# Altium project Board3.PrjPcb
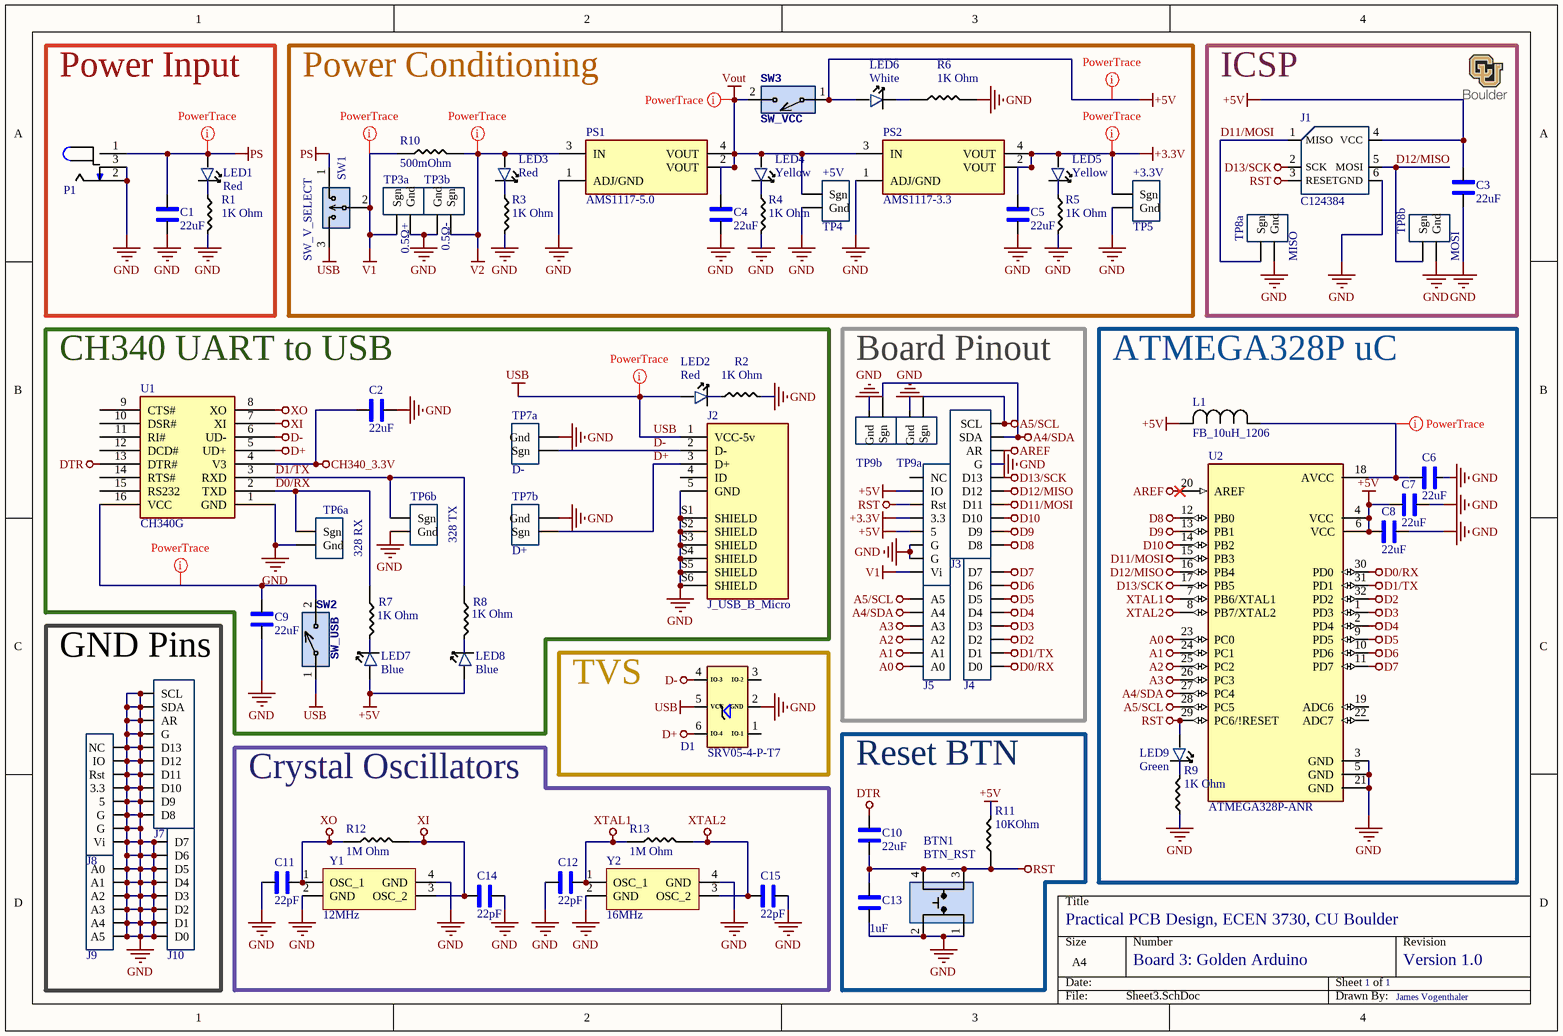
[diagram p0: Sheet3.SchDoc]
1 sheet, 72 parts. Net scope: global (net labels, ports and power ports of the same name join across sheets).
Board file: PCB3.PcbDoc

## Sheet Sheet3.SchDoc: Golden Arduino
size A4; Author: James Vogenthaler; CompanyName: CU Boulder; DrawnBy: James Vogenthaler; Engineer: James Vogenthaler; Organization: CU Boulder; Address1: Boulder, CO; DocumentNumber: 3; Revision: Board 3; SheetNumber: 1; SheetTotal: 1

### Parts
BTN1  BTN_RST  [Switch_JLC]
C1  22uF  [1206_Passive_Capacitor]
C2  22uF  [1206_Passive_Capacitor]
C3  22uF  [1206_Passive_Capacitor]
C4  22uF  [1206_Passive_Capacitor]
C5  22uF  [1206_Passive_Capacitor]
C6  22uF  [1206_Passive_Capacitor]
C7  22uF  [1206_Passive_Capacitor]
C8  22uF  [1206_Passive_Capacitor]
C9  22uF  [1206_Passive_Capacitor]
C10  22uF  [1206_Passive_Capacitor]
C11  22pF  [1206_Passive_Capacitor]
C12  22pF  [1206_Passive_Capacitor]
C13  1uF  [1206_Passive_Capacitor]
C14  22pF  [1206_Passive_Capacitor]
C15  22pF  [1206_Passive_Capacitor]
D1  SRV05-4-P-T7  [TVS]
J1  LCSC Part#: C124384  [ICSP]  (hidden comment: NRPN032PAEN-RC)
J2  J_USB_B_Micro  [AMPHENOL_10118194-0001LF]
J3  PPTC101LFBN-RC  [10_PIN_ARDUINO_100MIL]  (value not drawn)
J4  PPTC081LFBN-RC  [8_PIN_ARD-DIG_100MIL]  (value not drawn)
J5  PPTC061LFBN-RC  [6_PIN_ARD-Analog_100mil]  (value not drawn)
J6  PPTC081LFBN-RC  [8_PIN_ARD-PWR_100MIL]  (value not drawn)
J7  PPTC101LFBN-RC  [10_PIN_ARDUINO_100MIL]  (value not drawn)
J8  PPTC081LFBN-RC  [8_PIN_ARD-PWR_100MIL]  (value not drawn)
J9  PPTC061LFBN-RC  [6_PIN_ARD-Analog_100mil]  (value not drawn)
J10  PPTC081LFBN-RC  [8_PIN_ARD-DIG_100MIL]  (value not drawn)
L1  FB_10uH_1206  [AIML-1206_ABR-M]
LED1  value Red  [LED_1206]  (hidden comment: Power)
LED2  value Red  [LED_1206]  (hidden comment: USB)
LED3  value Red  [LED_1206]  (hidden comment: VIN)
LED4  value Yellow  [LED_1206]  (hidden comment: +5V)
LED5  value Yellow  [LED_1206]  (hidden comment: +3.3V)
LED6  White  [LED_1206]
LED7  value Blue  [LED_1206]  (hidden comment: RX)
LED8  value Blue  [LED_1206]  (hidden comment: TX)
LED9  value Green  [LED_1206]  (hidden comment: SCK)
P1  Power Jack  [Power_Jack]  (value not drawn)
PS1  AMS1117-5.0  [LDO]
PS2  AMS1117-3.3  [LDO]
R1  value 1K Ohm  [1206_Passive_Resitor]  (hidden comment: 1k)
R2  value 1K Ohm  [1206_Passive_Resitor]  (hidden comment: 1k)
R3  value 1K Ohm  [1206_Passive_Resitor]  (hidden comment: 1k)
R4  value 1K Ohm  [1206_Passive_Resitor]  (hidden comment: 1k)
R5  value 1K Ohm  [1206_Passive_Resitor]  (hidden comment: 1k)
R6  value 1K Ohm  [1206_Passive_Resitor]  (hidden comment: 1k)
R7  value 1K Ohm  [1206_Passive_Resitor]  (hidden comment: 1k)
R8  value 1K Ohm  [1206_Passive_Resitor]  (hidden comment: 1k)
R9  value 1K Ohm  [1206_Passive_Resitor]  (hidden comment: 1k)
R10  value 500mOhm  [1206_Passive_Resitor]  (hidden comment: 500m)
R11  value 10KOhm  [1206_Passive_Resitor]  (hidden comment: 10k)
R12  value 1M Ohm  [1206_Passive_Resitor]  (hidden comment: 1M)
R13  value 1M Ohm  [1206_Passive_Resitor]  (hidden comment: 1M)
SW1  SW_V_SELECT  [3_PIN_100mil]
SW2  SW_USB  [2Pin-Header-Conn]
SW3  SW_VCC  [2Pin-Header-Conn]
TP3a  0.5Ω+  [TP10x_Probe]
TP3b  0.5Ω-  [TP10x_Probe]
TP4  +5V  [TP10x_Probe]
TP5  +3.3V  [TP10x_Probe]
TP6a  328 RX  [TP10x_Probe]
TP6b  328 TX  [TP10x_Probe]
TP7a  D-  [TP10x_Probe]
TP7b  D+  [TP10x_Probe]
TP8a  MISO  [TP10x_Probe]
TP8b  MOSI  [TP10x_Probe]
TP9a  SDA  [TP10x_Probe]  (value not drawn)
TP9b  SCL  [TP10x_Probe]  (value not drawn)
U1  CH340G  [USB to serial]
U2  ATMEGA328P-ANR  [ATMega328P]
Y1  12MHz  [Crystal resonator]
Y2  value 16MHz  [Crystal resonator]  (hidden comment: X322516MLB4SI)

### Blocks framed on the sheet
Power Input: C1 LED1 P1 R1
Power Conditioning: C4 C5 LED3-LED6 PS1 PS2 R3-R6 R10 SW1 SW3 TP3a TP3b TP4 TP5
ICSP: C3 J1 TP8a TP8b
CH340 UART to USB: C2 C9 J2 LED2 LED7 LED8 R2 R7 R8 SW2 TP6a TP6b TP7a TP7b U1
Board Pinout: J3-J6 TP9a TP9b
ATMEGA328P uC: C6-C8 L1 LED9 R9 U2
GND Pins: J7-J10
TVS: D1
Reset BTN: BTN1 C10 C13 R11
Crystal Oscillators: C11 C12 C14 C15 R12 R13 Y1 Y2

### Nets
+3.3V: C5.2 J6.4(3.3) LED5.1 PS2.2(VOUT) PS2.4(VOUT) TP5.1(Sgn)
+5V: C3.2 C7.2 C8.2 J1.4(VCC) J6.2(IO) J6.5 L1.2 LED6.1 LED7.1 LED8.1 R11.2 SW3.1 U2.4(VCC) U2.6(VCC)
A0: J5.1(A0) U2.23(PC0)
A1: J5.2(A1) U2.24(PC1)
A2: J5.3(A2) U2.25(PC2)
A3: J5.4(A3) U2.26(PC3)
A4/SDA: J3.2(SDA) J5.5(A4) TP9b.1(Sgn) U2.27(PC4)
A5/SCL: J3.1(SCL) J5.6(A5) TP9a.1(Sgn) U2.28(PC5)
AREF: J3.3(AR) U2.20(AREF)
CH340_3.3V: C2.2 U1.4(V3)
D0/RX: J4.8(D0) R7.1 TP6a.1(Sgn) U1.2(TXD) U2.30(PD0)
D1/TX: J4.7(D1) R8.1 TP6b.1(Sgn) U1.3(RXD) U2.31(PD1)
D2: J4.6(D2) U2.32(PD2)
D3: J4.5(D3) U2.1(PD3)
D4: J4.4(D4) U2.2(PD4)
D5: J4.3(D5) U2.9(PD5)
D6: J4.2(D6) U2.10(PD6)
D7: J4.1(D7) U2.11(PD7)
D8: J3.10(D8) U2.12(PB0)
D9: J3.9(D9) U2.13(PB1)
D10: J3.8(D10) U2.14(PB2)
D11/MOSI: J1.1(MISO) J3.7(D11) TP8a.1(Sgn) U2.15(PB3)
D12/MISO: J1.5(MOSI) J3.6(D12) TP8b.1(Sgn) U2.16(PB4)
D13/SCK: J1.2(SCK) J3.5(D13) U2.17(PB5)
D+: D1.6(IO-4) J2.3(D+) TP7b.1(Sgn) U1.5(UD+)
D-: D1.4(IO-3) J2.2(D-) TP7a.1(Sgn) U1.6(UD-)
DTR: C10.1 U1.13(DTR#)
GND: BTN1.1 BTN1.2 C1.1 C2.1 C3.1 C4.1 C5.1 C6.1 C7.1 C8.1 C9.1 C11.2 C12.2 C13.1 C14.2 C15.2 D1.2(GND) J1.6(GND) J2.5(GND) J2.S1(SHIELD) J2.S2(SHIELD) J2.S3(SHIELD) J2.S4(SHIELD) J2.S5(SHIELD) J2.S6(SHIELD) J3.4(G) J6.6(G) J6.7(G) J7.1(SCL) J7.2(SDA) J7.3(AR) J7.4(G) J7.5(D13) J7.6(D12) J7.7(D11) J7.8(D10) J7.9(D9) J7.10(D8) J8.1(NC) J8.2(IO) J8.3(Rst) J8.4(3.3) J8.5 J8.6(G) J8.7(G) J8.8(Vi) J9.1(A0) J9.2(A1) J9.3(A2) J9.4(A3) J9.5(A4) J9.6(A5) J10.1(D7) J10.2(D6) J10.3(D5) J10.4(D4) J10.5(D3) J10.6(D2) J10.7(D1) J10.8(D0) P1.2 P1.3 PS1.1(ADJ/GND) PS2.1(ADJ/GND) R1.2 R2.2 R3.2 R4.2 R5.2 R6.2 R9.1 TP3a.2(Gnd) TP3b.2(Gnd) TP4.2(Gnd) TP5.2(Gnd) TP6a.2(Gnd) TP6b.2(Gnd) TP7a.2(Gnd) TP7b.2(Gnd) TP8a.2(Gnd) TP8b.2(Gnd) TP9a.2(Gnd) TP9b.2(Gnd) U1.1(GND) U2.3(GND) U2.5(GND) U2.21(GND) Y1.2(GND) Y1.4(GND) Y2.2(GND) Y2.4(GND)
PS: C1.2 LED1.1 P1.1 SW1.1
RST: BTN1.3 BTN1.4 C10.2 C13.2 J1.3(RESET) J6.3(Rst) LED9.1 R11.1 U2.29(PC6/!RESET)
USB: D1.5(VCC) J2.1(VCC-5v) LED2.1 SW1.3 SW2.1
V1: J6.8(Vi) R10.1 SW1.2 TP3a.1(Sgn)
V2: LED3.1 PS1.3(IN) R10.2 TP3b.1(Sgn)
Vout: C4.2 LED4.1 PS1.2(VOUT) PS1.4(VOUT) PS2.3(IN) SW3.2 TP4.1(Sgn)
XI: C14.1 R12.2 U1.7(XI) Y1.3(OSC_2)
XO: C11.1 R12.1 U1.8(XO) Y1.1(OSC_1)
XTAL1: C12.1 R13.1 U2.7(PB6/XTAL1) Y2.1(OSC_1)
XTAL2: C15.1 R13.2 U2.8(PB7/XTAL2) Y2.3(OSC_2)
NetC6_2: C6.2 L1.1 U2.18(AVCC)
NetC9_2: C9.2 SW2.2 U1.16(VCC)
NetLED1_2: LED1.2 R1.1
NetLED2_2: LED2.2 R2.1
NetLED3_2: LED3.2 R3.1
NetLED4_2: LED4.2 R4.1
NetLED5_2: LED5.2 R5.1
NetLED6_2: LED6.2 R6.1
NetLED7_2: LED7.2 R7.2
NetLED8_2: LED8.2 R8.2
NetLED9_2: LED9.2 R9.2

Not connected (* = marked no-connect by the designer): D1 1(IO-1) 3(IO-2); J2 4(ID); J6 1(NC); U1 9(CTS#) 10(DSR#) 11(RI#) 12(DCD#) 14(RTS#) 15(RS232); U2 19(ADC6) 22(ADC7)

### Layout directives
rule Width Constraint [Pref Width = 20mil    Min Width = 10mil    Max Width = 100mil]: +3.3V, +5V, NetC6_2, NetC9_2, PS, USB, V1, V2, Vout

### Notes on the sheet
- Practical PCB Design, ECEN 3730, CU Boulder
- Board 3: Golden Arduino
- Version 1.0

### Library data of the parts
BTN1 = SW_Push_Button_JLC: Tactile Switch SPST-NO Top Actuated Surface Mount; MFR Part #: KH-4.5X4.5X4.3H-STM; LCSC Part#: C2837550; Type: Extended; DataSheet: https://datasheet.lcsc.com/lcsc/2106081532_Shenzhen-Kinghelm-Elec-KH-4.5X4.5X4.3H-STM_C2837550.pdf
C1-C10 = C_22uF_1206: 22uF ±10% 25V X5R 1206 Multilayer Ceramic Capacitors MLCC - SMD/SMT RoHS; MFR Part #: CL31A226KAHNNNE; Type: basic; LCSC Part#: C12891; Datasheet: https://datasheet.lcsc.com/lcsc/1811031514_Samsung-Electro-Mechanics-CL31A226KAHNNNE_C12891.pdf; Value: 22uF
C11 C12 C14 C15 = C_22pF_1206: 22pF ±5% 1kV C0G 1206 Multilayer Ceramic Capacitors MLCC - SMD/SMT RoHS; MFR Part #: CC1206JKNPOCBN220; Type: Extended; LCSC Part#: C107174; Datasheet: https://datasheet.lcsc.com/lcsc/1810241219_YAGEO-CC1206JKNPOCBN220_C107174.pdf; Value: 22pF
C13 = C_1uF_1206: MULTILAYER CERAMIC CAPACITORS MLCC - SMD/SMT 1UF 50V 1206 ROHS; MFR Part #: CL31B105KBHNNNE; Type: Basic; Digikey Link: https://www.digikey.com/product-detail/en/C1206C105M4RACTU/399-8150-1-ND/3471873/?itemSeq=304982366; LCSC Part#: C1848; Value: 1uF
D1 = D_TVS_Diode: TVS SOT-23-6 ROHS; Value: TVS DIODE 5.5V 6TSOP; Type: Basic; MFR Part #: SRV05-4-P-T7; LCSC Part#: C85364; Datasheet: https://datasheet.lcsc.com/szlcsc/ProTek-Devices-SRV05-4-P-T7_C85364.pdf
J1 = J_ICSP: Connector Header Through Hole 6 position 0.079" (2.00mm); pin to pad: 1>5 5>1; Digikey Link: https://www.digikey.com/product-detail/en/NRPN032PAEN-RC/S5801-03-ND/804955/?itemSeq=304982355; MFR Part #: NRPN032PAEN-RC; Type: Extended
J2 = J_USB_B_Micro: Micro Usb, 2.0 Type b, Rcpt, Smt; MFR: Amphenol ICC; MFR Part #: 10118194-0001LF; Digikey link: https://www.digikey.com/en/products/detail/amphenol-cs-fci/10118194-0001LF/2785389?s=N4IgTCBcDaIAQEYAMCEA4EE4AsBaJBCAMgGJwgC6AvkA; DataSheet: https://www.amphenol-cs.com/media/wysiwyg/files/drawing/10118194.pdf; LCSC Part#: C132563; Type: Extended
J3 J7 = JF_10_PIN_FEMA_ARDUINO: 10 Position Header Connector 0.100" (2.54mm) Through Hole Tin; Value: Female; Digikey Link: https://www.digikey.com/product-detail/en/PPTC101LFBN-RC/S7008-ND/810149/?itemSeq=304982352; MFR Part #: PPTC101LFBN-RC; LCSC Part#: C225507; Type: Extended
J4 J10 = JF_8_PIN_FEMA_ARD-Dig: 8 Position Header Connector 0.100" (2.54mm) Through Hole Tin; Value: Female; Digikey Link: https://www.digikey.com/product-detail/en/PPTC081LFBN-RC/S7006-ND/810147/?itemSeq=304982354; MFR Part #: PPTC081LFBN-RC; Type: Extended; LCSC Part#: C27438
J5 J9 = JF_6_PIN_FEMA_ARD-Anolog: 6 Position Header Connector 0.100" (2.54mm) Through Hole Tin; Value: Female; Digikey Link: https://www.digikey.com/product-detail/en/PPTC061LFBN-RC/S7004-ND/810145/?itemSeq=304982353; MFR Part #: PPTC061LFBN-RC; LCSC Part#: C40877; Type: Extended
J6 J8 = JF_8_PIN_FEMA_ARD-Pwr: 8 Position Header Connector 0.100" (2.54mm) Through Hole Tin; Value: Female; Digikey Link: https://www.digikey.com/product-detail/en/PPTC081LFBN-RC/S7006-ND/810147/?itemSeq=304982354; MFR Part #: PPTC081LFBN-RC; Type: Extended; LCSC Part#: C27438
L1 = FB_10uH_1206: 25mA 10uH ±10% 800mΩ 1206  Inductors (SMD) ROHS; Mfr_Name: FH (Guangdong Fenghua Advanced Tech); MFR PART #: CMI321609X100KT; Type: Basic; LCSC PART#: C1051; DataSheet: https://datasheet.lcsc.com/lcsc/1810311314_FH--Guangdong-Fenghua-Advanced-Tech-CMI321609X100KT_C1051.pdf
LED1-LED3 = LED_RED_1206: Red 621~631nm 1206 Light Emitting Diodes (LED) RoHS; MFR Part #: 15-21/R6C-FQ1R1B/2T; Type: Extended; LCSC Part#: C93133; Datasheet: https://datasheet.lcsc.com/szlcsc/1811151241_Everlight-Elec-15-21-R6C-FQ1R1B-2T_C93133.pdf
LED4 LED5 = LED_YELLOW_1206: yellow 1206  Light Emitting Diodes (LED) ROHS; MFR Part #: NCD1206Y1; Type: Extended; LCSC Part#: C93094; Datasheet: https://datasheet.lcsc.com/lcsc/2008201033_Foshan-NationStar-Optoelectronics-NCD1206Y1_C93094.pdf
LED6 = LED_WHITE_1206: White light 1206  Light Emitting Diodes (LED) ROHS; MFR Part #: NCD1206W1; Type: Extended; LCSC Part#: C130718; Datasheet: https://datasheet.lcsc.com/lcsc/2008201033_Foshan-NationStar-Optoelectronics-NCD1206W1_C130718.pdf; Value: White
LED7 LED8 = LED_BLUE_1206: blue 1206  Light Emitting Diodes (LED) ROHS; MFR Part #: NCD1206B1; Type: Extended; LCSC Part#: C130717; Datasheet: https://datasheet.lcsc.com/lcsc/2008201033_Foshan-NationStar-Optoelectronics-NCD1206B1_C130717.pdf
LED9 = LED_GREEN_1206: Green 513~528nm 1206 Light Emitting Diodes (LED) RoHS; MFR Part #: SZYY1206G; Type: Extended; LCSC Part#: C434439; Datasheet: https://datasheet.lcsc.com/lcsc/2006301532_Yongyu-Photoelectric-SZYY1206G_C434439.pdf
P1 = P_Power Jack: Power Barrel Connector Jack 2.10mm ID (0.083"), 5.50mm OD (0.217") Through Hole, Right Angle; MFR Part #: PJ-102A; Value: CONN PWR JACK 2X5.5MM SOLDER; Digikey Link: https://www.digikey.com/product-detail/en/PJ-102A/CP-102A-ND/275425/?itemSeq=304982367; LCSC Part#: C136744; Type: Extended
PS1 = PS_AMS_LDO_5V: LOW DROPOUT REGULATORS(LDO) POSITIVE FIXED 1.3V @ 1A 15V 5V 1A SOT-223 ROHS; Value: IC REG LINEAR 5V 1A SOT223; MFR Part #: AMS1117-5.0; LCSC Part#: C6187; Type: Basic
PS2 = PS_AMS_LDO_3v3: LOW DROPOUT REGULATORS(LDO) POSITIVE FIXED 1.3V @ 800MA 15V 3.3V 1A SOT-223 ROHS; Value: IC REG LINEAR 3.3V 800MA SOT223; MFR Part #: AMS1117-3.3; LCSC Part#: C6186; Type: Basic
R1-R9 = R_1K_1206: CHIP RESISTOR - SURFACE MOUNT 1KOHMS ±1% 1/4W 1206 ROHS; MFR Part #: RNCP1206FTD1K00CT; Digikey Link: https://www.digikey.com/product-detail/en/RNCP1206FTD1K00/RNCP1206FTD1K00CT-ND/2240675/?itemSeq=304982373; LCSC Part#: C4410; Type: Basic
R10 = R_500mOhm_1206: Resistors/Shunt 250mW 500mΩ ±800ppm/℃ ±5% 1206  Current Sense  Resistors ROHS; MFR Part #: 1206W4J050KT5E; Datasheet: https://datasheet.lcsc.com/lcsc/1810301438_UNI-ROYAL-Uniroyal-Elec-1206W4J050KT5E_C247433.pdf; LCSC Part#: C247433; Type: Extended
R11 = R_10KOhm_1206: 10 kOhms ±5% 0.25W, 1/4W Chip Resistor 1206 (3216 Metric) Automotive AEC-Q200 Thick Film; MFR Part #: RMCF1206FT10K0; Digikey Link: https://www.digikey.com/en/products/detail/stackpole-electronics-inc/RMCF1206FT10K0/1759669; LCSC Part#: C17902; Type: Basic
R12 R13 = R_1M_1206: CHIP RESISTOR - SURFACE MOUNT 1MOHMS ±1% 1/4W 1206 ROHS; MFR Part #: RMCF1206JT1M00; Digikey Link: https://www.digikey.com/product-detail/en/RMCF1206JT1M00/RMCF1206JT1M00CT-ND/1942830/?itemSeq=304982358; LCSC Part#: C17927; Type: Basic
SW1 = SW_3Pin_100mil_Switch: Connector Header Through Hole 3 position 0.100" (2.54mm); MFR Part #: PREC003SAAN-RC; Value: CONN HEADER VERT 3POS 2.54MM; Digikey Link: https://www.digikey.com/product-detail/en/PREC003SAAN-RC/S1012EC-03-ND/2774851/?itemSeq=304982371; Type: Extended; LCSC Part#: C49257
SW2 SW3 = SW_2Pin_100mil_Switch: 2Pin Header; LCSC Part#: C124375; Type: Extended
TP3a TP3b TP4 TP5 TP6a TP6b TP7a TP7b TP8a TP8b TP9a TP9b = TP_10x_Probe: Test Point 300 mil centers
U1 = U_USBtoSerial: Transceiver USB 2.0 2Mbps SOP-16_150mil USB ICs RoHS; Datasheet: https://datasheet.lcsc.com/lcsc/2008191806_WCH-Jiangsu-Qin-Heng-CH340G_C14267.pdf; LCSC Part#: C14267; MFR Part #: CH340G; Type: Basic; Value: USB to Serial
U2 = U_ATMega328P: AVR AVR® ATmega Microcontroller IC 8-Bit 20MHz 32KB (16K x 16) FLASH 32-TQFP (7x7); MFR Part #: ATMEGA328P-AU; Value: IC MCU 8BIT 32KB FLASH 32TQFP; Digikey Link: https://www.digikey.com/product-detail/en/ATMEGA328P-ANR/ATMEGA328P-ANRCT-ND/2774230/?itemSeq=304982365; LCSC Part#: C14877; Type: Basic
Y1 = X_12MHz_Res: SMD Crystal Resonators 12MHz ±10ppm SMD-3225_4P RoHS; MFR Part #: X322512MSB4SI; LCSC Part#: C9002; Value: 12MHz; Type: Basic; Datasheet: https://datasheet.lcsc.com/szlcsc/Yangxing-Tech-X322512MSB4SI_C9002.pdf
Y2 = X_16Mhz_Res: ±10ppm 16000000Hz -40℃~85℃ 贴片无源晶振 60Ω 9pF SMD3225-4P Crystals ROHS; LCSC Part#: C13738; MFR Part #: X322516MLB4SI; Type: Basic